# EAGLE design Plus (EAGLE 6.1)
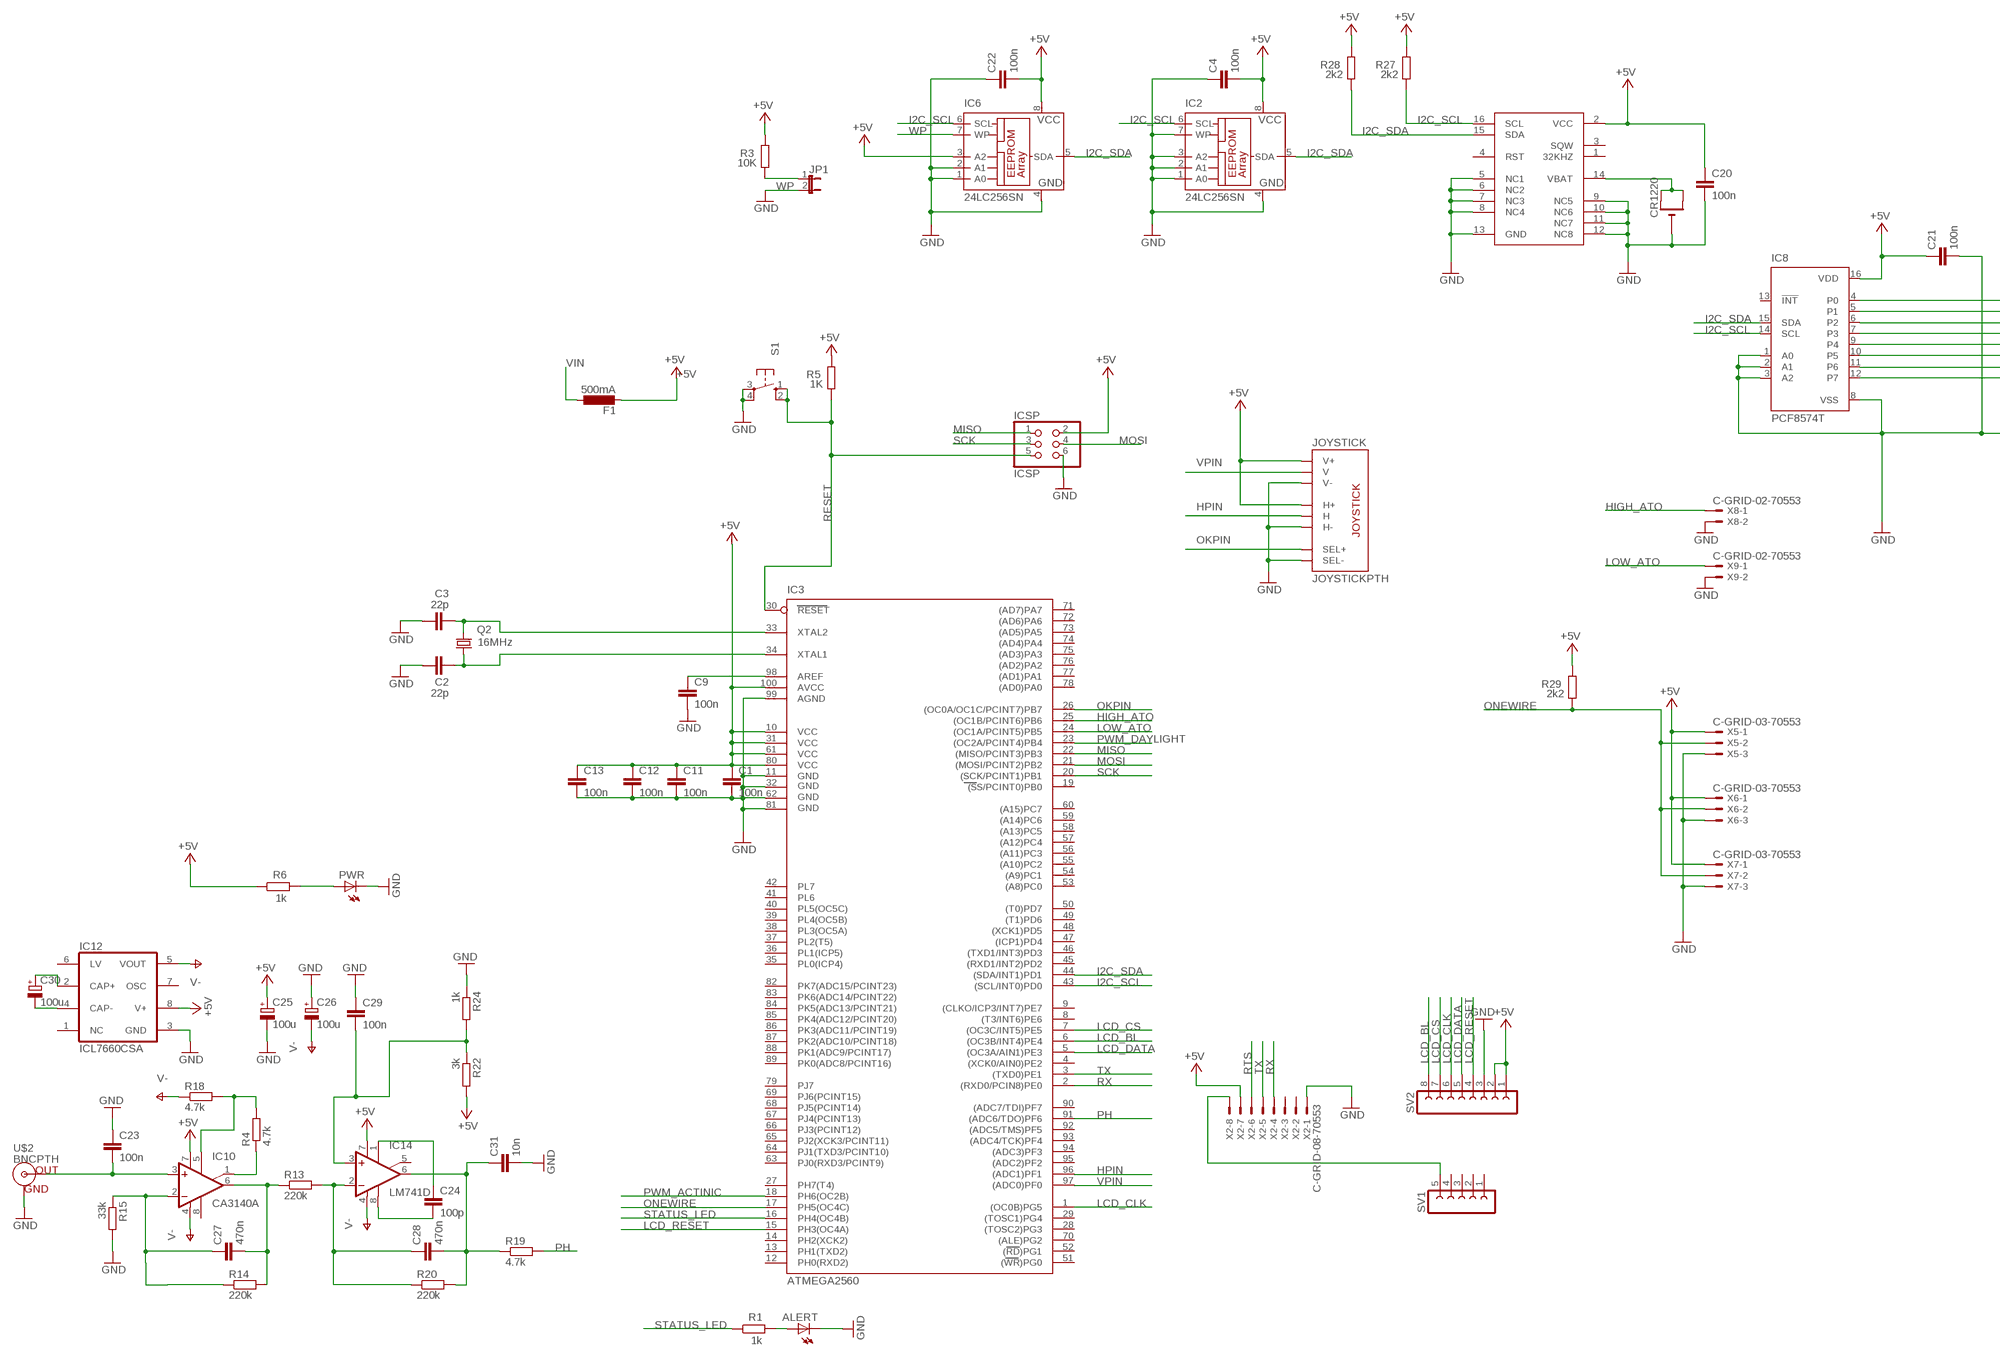
[diagram p0: schematic, sheet 1, part 1 of 2]
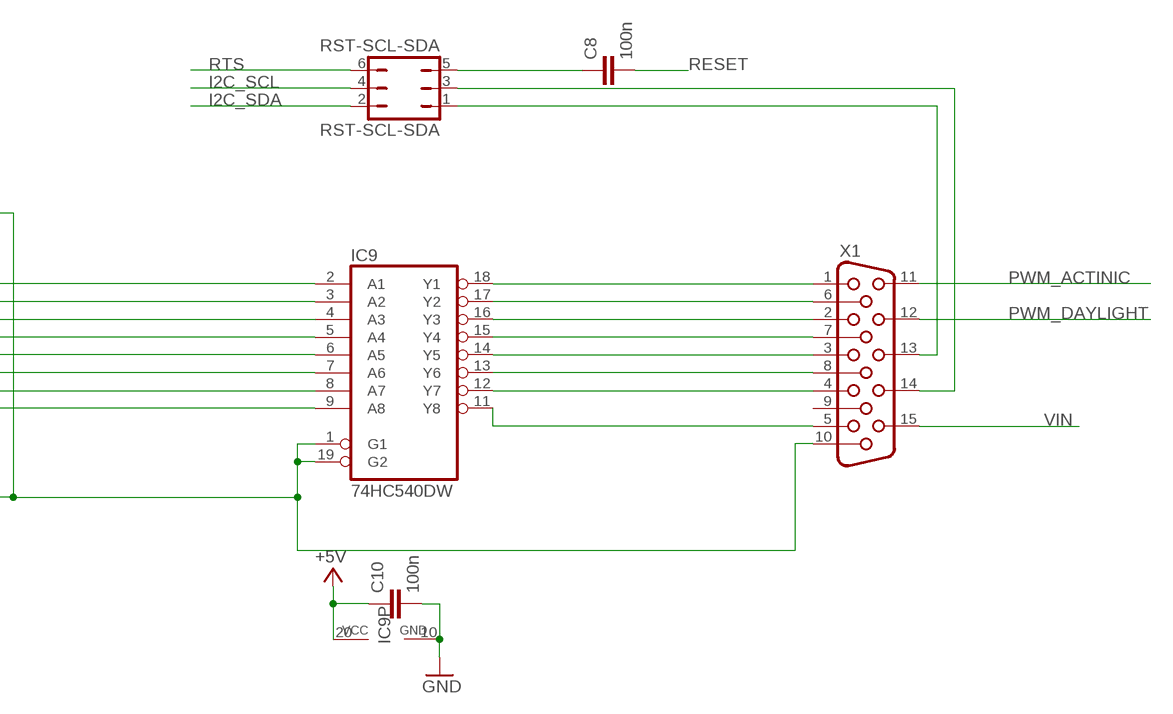
[diagram p1: schematic, sheet 1, part 2 of 2]

## Parts
ALERT  LED3MM  [LED3MM]
C1  100n  C-EUC0805  [C0805]
C2  22p  C-EUC0805  [C0805]
C3  22p  C-EUC0805  [C0805]
C4  100n  C-EUC0805  [C0805]
C8  100n  C-EUC0805  [C0805]
C9  100n  C-EUC0805  [C0805]
C10  100n  C-EUC0805  [C0805]
C11  100n  C-EUC0805  [C0805]
C12  100n  C-EUC0805  [C0805]
C13  100n  C-EUC0805  [C0805]
C20  100n  C-EUC0805  [C0805]
C21  100n  C-EUC0805  [C0805]
C22  100n  C-EUC0805  [C0805]
C23  100n  C-EUC0805  [C0805]
C24  100p  C-EUC0805  [C0805]
C25  100u  CPOL-EUD  [PANASONIC_D]
C26  100u  CPOL-EUD  [PANASONIC_D]
C27  470n  C-EUC0805  [C0805]
C28  470n  C-EUC0805  [C0805]
C29  100n  C-EUC0805  [C0805]
C30  100u  CPOL-EUD  [PANASONIC_D]
C31  10n  C-EUC0805  [C0805]
CR1220  CR1220SMT  [CR1220-SMD]
F1  500mA  L-EUL1812  [L1812]
IC2  24LC256SN  [SO-08]
IC3  ATMEGA2560  ATMEGA1280-16AU  [TQFP100]
IC6  24LC256SN  [SO-08]
IC7  DS3231W  [SO16W]
IC8  PCF8574T  [SO16W]
IC9  74HC540DW  [SO20W]
IC10  CA3140A  CA3140D  [SO08]
IC12  ICL7660CSA  [SO08]
IC14  LM741D  [SO08]
ICSP  ICSP  PINHD-2X3  [2X03]
JOYSTICK  JOYSTICKPTH  [JOYSTICK]
JP1  JP1E  [JP1]
PWR  LED3MM  [LED3MM]
Q2  16MHz  CRYTALHC49S  [HC49/S]
R1  1k  R-EU_R0805  [R0805]
R3  10K  R-EU_R0805  [R0805]
R4  4.7k  R-EU_R0805  [R0805]
R5  1K  R-EU_R0805  [R0805]
R6  1k  R-EU_R0805  [R0805]
R13  220k  R-EU_R0805  [R0805]
R14  220k  R-EU_R0805  [R0805]
R15  33k  R-EU_R0805  [R0805]
R18  4.7k  R-EU_R0805  [R0805]
R19  4.7k  R-EU_R0805  [R0805]
R20  220k  R-EU_R0805  [R0805]
R22  3k  R-EU_R0805  [R0805]
R24  1k  R-EU_R0805  [R0805]
R27  2k2  R-EU_R0805  [R0805]
R28  2k2  R-EU_R0805  [R0805]
R29  2k2  R-EU_R0805  [R0805]
RST-SCL-SDA  RST-SCL-SDA  JP3Q  [JP3Q]
S1  10-XX  [B3F-10XX]
SV1  FE05-1  [FE05-1]
SV2  FE08-1  [FE08]
U$2  BNCPTH  [BNC]
X1  HF15H  [HDF15H]
X2  C-GRID-08-70553  [70553-08]
X5  C-GRID-03-70553  [70553-03]
X6  C-GRID-03-70553  [70553-03]
X7  C-GRID-03-70553  [70553-03]
X8  C-GRID-02-70553  [70553-02]
X9  C-GRID-02-70553  [70553-02]

## Nets
+5V: C1.1 C4.2 C10.1 C11.1 C12.1 C13.1 C20.1 C21.1 C22.2 C25.+ F1.2 IC2.8(VCC) IC3.10(VCC) IC3.31(VCC1) IC3.61(VCC2) IC3.80(VCC3) IC3.100(AVCC) IC6.3(A2) IC6.8(VCC) IC7.2(VCC) IC8.16(VDD) IC9.20(VCC) IC10.7(V+) IC12.8(V+) IC14.7(V+) ICSP.2 JOYSTICK.H1(H+) JOYSTICK.V1(V+) R3.2 R5.2 R6.1 R22.2 R27.2 R28.2 R29.2 SV2.1 SV2.2 X2.7 X5.1 X6.1 X7.1
GND [gnd]: ALERT.K(C) C1.2 C2.1 C3.1 C4.1 C9.2 C10.2 C11.2 C12.2 C13.2 C20.2 C21.2 C22.1 C23.1 C25.- C26.+ C29.1 C31.2 CR1220.- IC2.1(A0) IC2.2(A1) IC2.3(A2) IC2.4(GND) IC2.7(WP) IC3.11(GND) IC3.32(GND1) IC3.62(GND2) IC3.81(GND3) IC3.99(AGND) IC6.1(A0) IC6.2(A1) IC6.4(GND) IC7.5(NC1) IC7.6(NC2) IC7.7(NC3) IC7.8(NC4) IC7.9(NC5) IC7.10(NC6) IC7.11(NC7) IC7.12(NC8) IC7.13(GND) IC8.1(A0) IC8.2(A1) IC8.3(A2) IC8.8(VSS) IC9.1(G1) IC9.10(GND) IC9.19(G2) IC12.3(GND) ICSP.6 JOYSTICK.B2A(SEL-) JOYSTICK.H3(H-) JOYSTICK.V3(V-) JP1.2 PWR.K(C) R15.2 R24.1 S1.3(P) S1.4(P1) SV2.3 U$2.GND X1.10 X2.1 X5.3 X6.3 X7.3 X8.2 X9.2
HIGH_ATO: IC3.25((OC1B/PCINT6)PB6) X8.1
HPIN: IC3.96((ADC1)PF1) JOYSTICK.H2(H)
I2C_SCL: IC2.6(SCL) IC3.43((SCL/INT0)PD0) IC6.6(SCL) IC7.16(SCL) IC8.14(SCL) R27.1 RST-SCL-SDA.4
I2C_SDA: IC2.5(SDA) IC3.44((SDA/INT1)PD1) IC6.5(SDA) IC7.15(SDA) IC8.15(SDA) R28.1 RST-SCL-SDA.2
LCD_BL: IC3.6((OC3B/INT4)PE4) SV2.8
LCD_CLK: IC3.1((OC0B)PG5) SV2.6
LCD_CS: IC3.7((OC3C/INT5)PE5) SV2.7
LCD_DATA: IC3.5((OC3A/AIN1)PE3) SV2.5
LCD_RESET: IC3.15(PH3(OC4A)) SV2.4
LOW_ATO: IC3.24((OC1A/PCINT5)PB5) X9.1
MISO: IC3.22((MISO/PCINT3)PB3) ICSP.1
MOSI: IC3.21((MOSI/PCINT2)PB2) ICSP.4
N$1: C9.1 IC3.98(AREF)
N$2: CR1220.+$1(+) CR1220.+$2(+1) IC7.14(VBAT)
N$3: PWR.A R6.2
N$6: C2.2 IC3.34(XTAL1) Q2.1
N$7: C3.2 IC3.33(XTAL2) Q2.2
N$8: IC9.18(Y1) X1.1
N$12: C24.1 IC14.1(ON1)
N$16: RST-SCL-SDA.1 X1.13
N$17: IC9.17(Y2) X1.6
N$20: RST-SCL-SDA.3 X1.14
N$21: IC9.16(Y3) X1.2
N$23: IC9.15(Y4) X1.7
N$25: IC9.14(Y5) X1.3
N$26: IC9.13(Y6) X1.8
N$27: IC9.12(Y7) X1.4
N$28: IC9.11(Y8) X1.5
N$29: IC8.4(P0) IC9.2(A1)
N$30: IC8.5(P1) IC9.3(A2)
N$32: IC8.6(P2) IC9.4(A3)
N$33: IC8.7(P3) IC9.5(A4)
N$34: IC8.9(P4) IC9.6(A5)
N$35: IC8.10(P5) IC9.7(A6)
N$36: IC8.11(P6) IC9.8(A7)
N$39: IC8.12(P7) IC9.9(A8)
N$41: C29.2 IC14.3(+IN) R22.1 R24.2
N$42: C30.- IC12.4(CAP-)
N$43: C30.+ IC12.2(CAP+)
N$44: C23.2 IC10.3(+IN) U$2.S(OUT)
N$45: C24.2 IC14.8(OPT)
N$47: C27.2 IC10.6(OUT) R13.1 R14.2
N$48: C27.1 IC10.2(-IN) R14.1 R15.1
N$49: C8.1 RST-SCL-SDA.5
N$50: IC10.5(ON) R4.2 R18.2
N$51: IC10.1(ON/CMP) R4.1
N$53: C28.1 IC14.2(-IN) R13.2 R20.1
N$55: C28.2 C31.1 IC14.6(OUT) R19.1 R20.2
N$63: ALERT.A R1.2
N$72: SV1.5 X2.8
OKPIN: IC3.26((OC0A/OC1C/PCINT7)PB7) JOYSTICK.B1A(SEL+)
ONEWIRE: IC3.17(PH5(OC4C)) R29.1 X5.2 X6.2 X7.2
PH: IC3.91((ADC6/TDO)PF6) R19.2
PWM_ACTINIC: IC3.18(PH6(OC2B)) X1.11
PWM_DAYLIGHT: IC3.23((OC2A/PCINT4)PB4) X1.12
RESET: C8.2 IC3.30(RESET) ICSP.5 R5.1 S1.1(S) S1.2(S1)
RTS: RST-SCL-SDA.6 X2.6
RX: IC3.2((RXD0/PCIN8)PE0) X2.4
SCK: IC3.20((SCK/PCINT1)PB1) ICSP.3
STATUS_LED: IC3.16(PH4(OC4B)) R1.1
TX: IC3.3((TXD0)PE1) X2.5
V-: C26.- IC10.4(V-) IC12.5(VOUT) IC14.4(V-) R18.1
VIN [power]: F1.1 X1.15
VPIN: IC3.97((ADC0)PF0) JOYSTICK.V2(V)
WP: IC6.7(WP) JP1.1 R3.1
Unconnected: IC3.4((XCK0/AIN0)PE2) IC3.8((T3/INT6)PE6) IC3.9((CLKO/ICP3/INT7)PE7) IC3.12(PH0(RXD2)) IC3.13(PH1(TXD2)) IC3.14(PH2(XCK2)) IC3.19((SS/PCINT0)PB0) IC3.27(PH7(T4)) IC3.28((TOSC2)PG3) IC3.29((TOSC1)PG4) IC3.35(PL0(ICP4)) IC3.36(PL1(ICP5)) IC3.37(PL2(T5)) IC3.38(PL3(OC5A)) IC3.39(PL4(OC5B)) IC3.40(PL5(OC5C)) IC3.41(PL6) IC3.42(PL7) IC3.45((RXD1/INT2)PD2) IC3.46((TXD1/INT3)PD3) IC3.47((ICP1)PD4) IC3.48((XCK1)PD5) IC3.49((T1)PD6) IC3.50((T0)PD7) IC3.51((WR)PG0) IC3.52((RD)PG1) IC3.53((A8)PC0) IC3.54((A9)PC1) IC3.55((A10)PC2) IC3.56((A11)PC3) IC3.57((A12)PC4) IC3.58((A13)PC5) IC3.59((A14)PC6) IC3.60((A15)PC7) IC3.63(PJ0(RXD3/PCINT9)) IC3.64(PJ1(TXD3/PCINT10)) IC3.65(PJ2(XCK3/PCINT11)) IC3.66(PJ3(PCINT12)) IC3.67(PJ4(PCINT13)) IC3.68(PJ5(PCINT14)) IC3.69(PJ6(PCINT15)) IC3.70((ALE)PG2) IC3.71((AD7)PA7) IC3.72((AD6)PA6) IC3.73((AD5)PA5) IC3.74((AD4)PA4) IC3.75((AD3)PA3) IC3.76((AD2)PA2) IC3.77((AD1)PA1) IC3.78((AD0)PA0) IC3.79(PJ7) IC3.82(PK7(ADC15/PCINT23)) IC3.83(PK6(ADC14/PCINT22)) IC3.84(PK5(ADC13/PCINT21)) IC3.85(PK4(ADC12/PCINT20)) IC3.86(PK3(ADC11/PCINT19)) IC3.87(PK2(ADC10/PCINT18)) IC3.88(PK1(ADC9/PCINT17)) IC3.89(PK0(ADC8/PCINT16)) IC3.90((ADC7/TDI)PF7) IC3.92((ADC5/TMS)PF5) IC3.93((ADC4/TCK)PF4) IC3.94((ADC3)PF3) IC3.95((ADC2)PF2) IC7.1(32KHZ) IC7.3(SQW) IC7.4(RST) IC8.13(!INT) IC10.8(CMP) IC12.1(NC) IC12.6(LV) IC12.7(OSC) IC14.5(ON2) SV1.1 SV1.2 SV1.3 SV1.4 X1.9 X2.2 X2.3

## Library data of the parts
ALERT PWR = led:LED: LED OSRAM: - CHIPLED LG R971, LG N971, LY N971, LG Q971, LY Q971, LO R971, LY R971 LH N974, LH R974 LS Q976, LO Q976, LY Q976 LO Q996 - Hyper CHIPLED LW Q18S LB Q993, LB Q99A, LB R99A - SideLED LS A670, LO A670, LY A670, LG A670, LP A670 LB A673, LV A673, LT A673, LW A673 LH A674 LY A675 LS A676, LA A676, LO A676, LY A676, LW A676 LS A679, LY A679, LG A679 - Hyper Micro SIDELED® LS Y876, LA Y876, LO Y876, LY Y876 LT Y87S - SmartLED LW L88C, LW L88S LB L89C, LB L89S, LG L890 LS L89K, LO L89K, LY L89K LS L896, LA L896, LO L896, LY L896 - TOPLED LS T670, LO T670, LY T670, LG T670, LP T670 LSG T670, LSP T670, LSY T670, LOP T670, LYG T670 LG T671, LOG T671, LSG T671 LB T673, LV T673, LT T673, LW T673 LH T674 LS T676, LA T676, LO T676, LY T676, LB T676, LH T676, LSB T676, LW T676 LB T67C, LV T67C, LT T67C, LS T67K, LO T67K, LY T67K, LW E67C LS E67B, LA E67B, LO E67B, LY E67B, LB E67C, LV E67C, LT E67C LW T67C LS T679, LY T679, LG T679 LS T770, LO T770, LY T770, LG T770, LP T770 LB T773, LV T773, LT T773, LW T773 LH T774 LS E675, LA E675, LY E675, LS T675 LS T776, LA T776, LO T776, LY T776, LB T776 LHGB T686 LT T68C, LB T68C - Hyper Mini TOPLED® LB M676 - Mini TOPLED Santana® LG M470 LS M47K, LO M47K, LY M47K Source: http://www.osram.convergy.de LUXEON: - LUMILED® LXK2-PW12-R00, LXK2-PW12-S00, LXK2-PW14-U00, LXK2-PW14-V00 LXK2-PM12-R00, LXK2-PM12-S00, LXK2-PM14-U00 LXK2-PE12-Q00, LXK2-PE12-R00, LXK2-PE12-S00, LXK2-PE14-T00, LXK2-PE14-U00 LXK2-PB12-K00, LXK2-PB12-L00, LXK2-PB12-M00, LXK2-PB14-N00, LXK2-PB14-P00, LXK2-PB14-Q00 LXK2-PR12-L00, LXK2-PR12-M00, LXK2-PR14-Q00, LXK2-PR14-R00 LXK2-PD12-Q00, LXK2-PD12-R00, LXK2-PD12-S00 LXK2-PH12-R00, LXK2-PH12-S00 LXK2-PL12-P00, LXK2-PL12-Q00, LXK2-PL12-R00 Source: www.luxeon.com KINGBRIGHT: KA-3528ASYC Source: www.kingbright.com
C1-C4 C8-C13 C20-C24 C27-C29 C31 = rcl:C-EU: CAPACITOR, European symbol
C25 C26 C30 = rcl:CPOL-EU: POLARIZED CAPACITOR, European symbol
CR1220 = adafruit:CR1220: CR1216/CR1220/CR1225 12mm 3V lithium coin cell Great for battery packup. Both SMT and THM holders. Note the THM package has the ground pads on both sides of the PCB so that the masks are the same - this reduces the cost
F1 = rcl:L-EU: INDUCTOR, European symbol
IC2 IC6 = microchip:24*: Serial EEPROM I2C
IC3 = atmel-2005:ATMEGA*: MICROCONTROLLER 64/128/256 Kbytes FLASH 4 Kbytes EEPROM 8 Kbytes SRAM 86 General Purpose I/O pins 12-channels16-bit PWM 4 x Serial USARTs 16-channels 10-bit A/D
IC7 = DS3231:DS3231
IC8 = micro-philips:PCF8574: I2C-Bus Remote 8-bit I/O expander http://www.semiconductors.philips.com/acrobat_download/datasheets/PCF8574_4.pdf
IC9 = 74xx-eu:74*540: Octal BUFFER and LINE DRIVER, 3-state
IC10 = linear:CA3140: OP AMP
IC12 = maxim:ICL7660CSA: VOLTAGE CONVERTER
IC14 = linear:*741: OP AMP
ICSP = pinhead:PINHD-2X3: PIN HEADER
JOYSTICK = SparkFun:JOYSTICK: Thumb Joystick Joystick commonly found in PS2 controllers. Two pots and a select switch. Footprint proven. Spark Fun Electronics SKU : COM-09032
JP1 = jumper:JP1E: JUMPER
Q2 = crystal:CRYTAL: CRYSTAL
R1 R3-R6 R13-R15 R18-R20 R22 R24 R27-R29 = rcl:R-EU_: RESISTOR, European symbol
RST-SCL-SDA = jumper:JP3Q: JUMPER
S1 = switch-omron:10-XX: OMRON SWITCH
SV1 = con-lsta:FE05-1: FEMALE HEADER
SV2 = con-lsta:FE08-1: FEMALE HEADER
U$2 = SparkFun:BNC: BNC Connector, Mouser Part# 5227161
X1 = con-subd:HF15: SUB-D
X2 = con-molex:C-GRID-08: CONNECTOR wire to board 2.54 mm (0.100") pitch header
X5-X7 = con-molex:C-GRID-03: CONNECTOR wire to board 2.54 mm (0.100") pitch header
X8 X9 = con-molex:C-GRID-02: CONNECTOR wire to board 2.54 mm (0.100") pitch header

## Net classes
0 default: width 0.254 mm, drill 0.254 mm, clearance 0.203 mm
1 power: width 0.61 mm, drill 0.508 mm, clearance 0.203 mm
2 gnd: width 0.254 mm, drill 0.508 mm, clearance 0.203 mm
3 usbvcc: width 0.508 mm, drill 0.508 mm, clearance 0.203 mm
4 aref: width 0.406 mm, clearance 0.203 mm

## Board
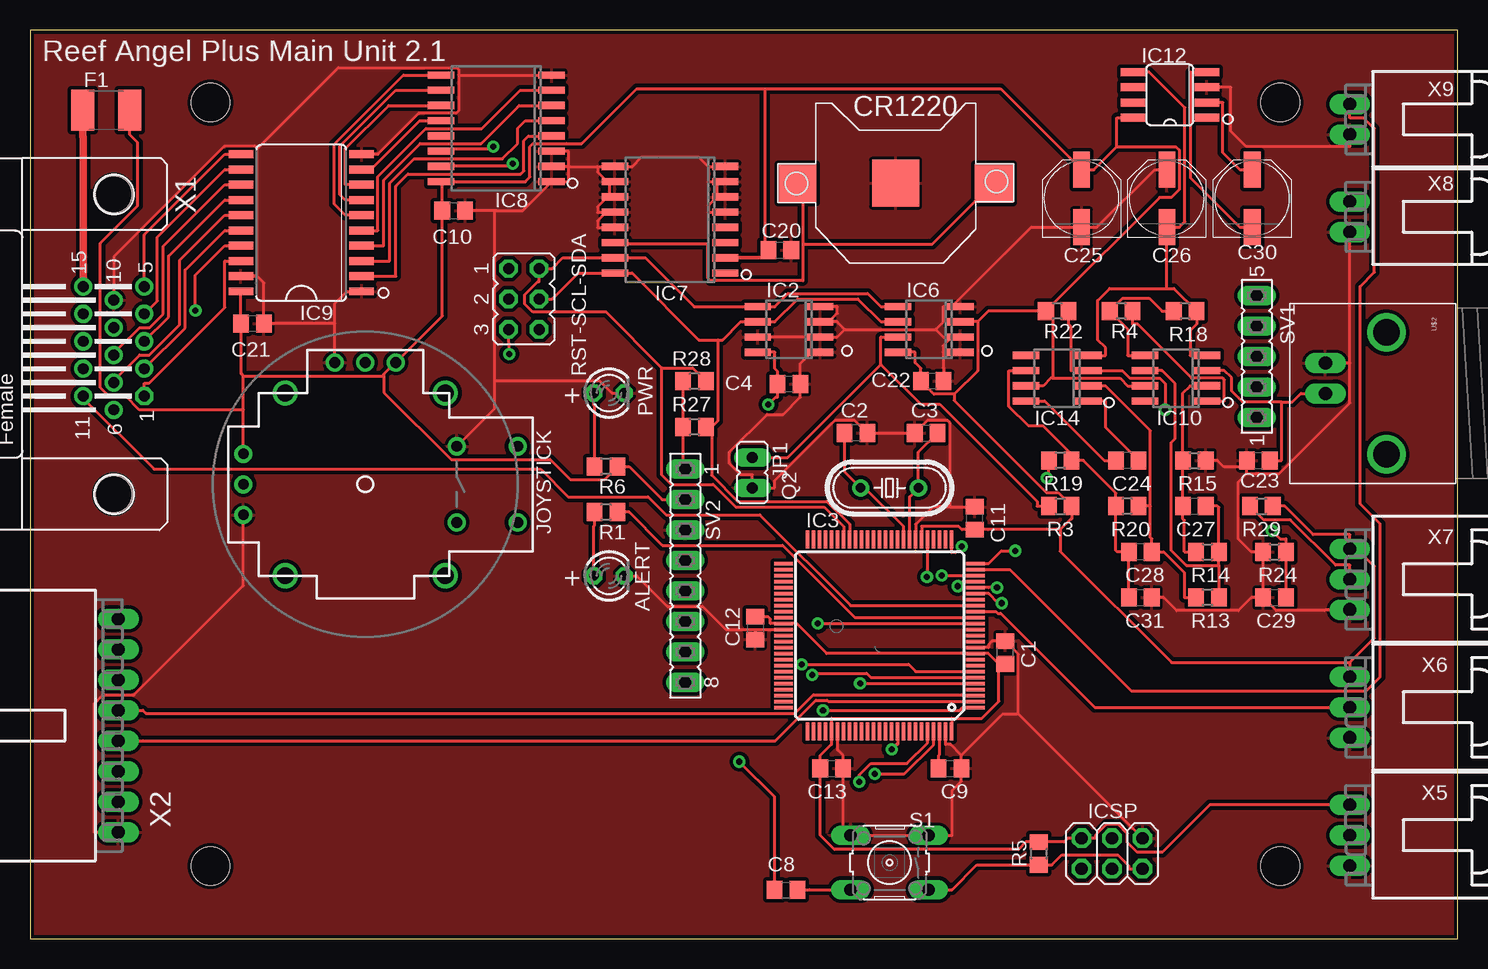
[diagram p2: board, top side]
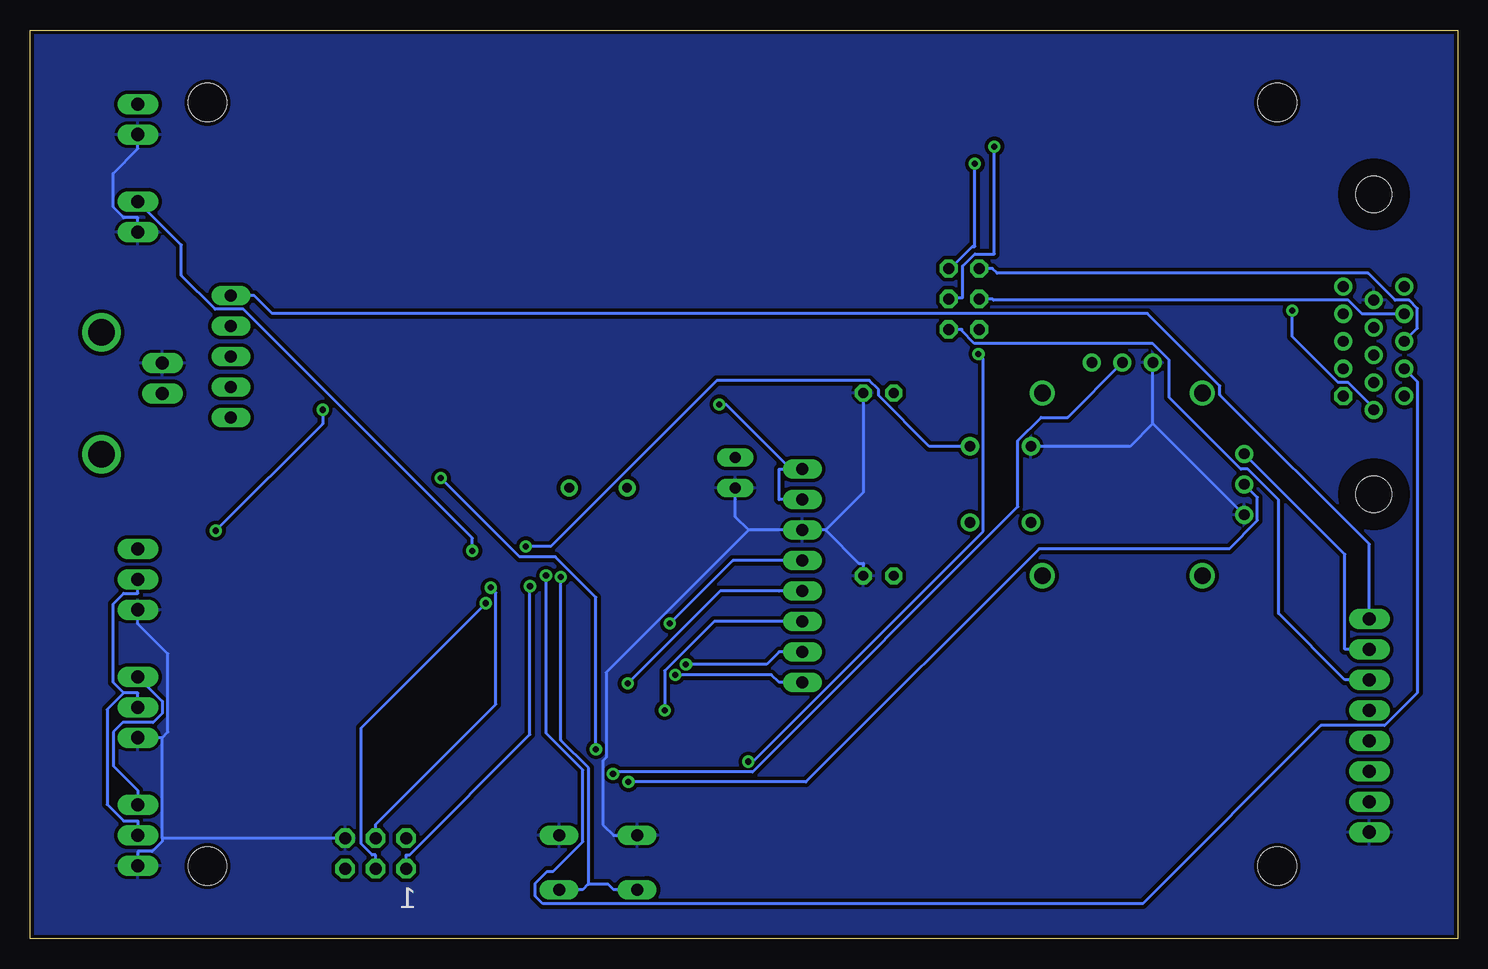
[diagram p3: board, bottom side, seen from below]

Size 118.97 x 75.77 mm. Coordinates in mm from the lower left corner, seen from the top.
Outline: 118.97,0 118.97,75.77 0,75.77 0,0 118.97,0
Copper layers (1*16): Top 0.035mm / dielectric 1.5mm / Bottom 0.035mm
Design rules: minimum track width 8mil, minimum drill 20mil, track to track 8mil, track to pad 8mil, pad to pad 8mil, via to via 8mil, smd to smd 8mil, copper to edge 10mil, drill to drill 8mil, minimum pad ring 12mil, minimum via ring 10mil, stop-mask expansion 4mil, vias tented up to drill 25mil, thermal gap 10mil
Holes 3.2 mm at 15.04,6.06 15.04,69.71 104.19,69.71 104.19,6.06
tKeepout: area 12.2,66.9 to 17.9,72.6; area 12.2,3.2 to 17.9,8.9; area 101.4,3.2 to 107,8.9; area 101.4,66.9 to 107,72.6; area 4.5,59.2 to 10.2,64.9; area 4.5,34.2 to 10.2,39.9
bKeepout: area 12.2,66.9 to 17.9,72.6; area 4.5,59.2 to 10.2,64.9; area 4.5,34.2 to 10.2,39.9; area 12.2,3.2 to 17.9,8.9; area 101.4,66.9 to 107,72.6; area 101.4,3.2 to 107,8.9

### Footprints (pad centres in the part's own frame; a part is rotated, then mirrored left to right if it is on the bottom)
LED3MM = drill 0.813 octagon: A -1.27,0; K 1.27,0
C0805 = smd 1.3 x 1.5: 1 -0.95,0; 2 0.95,0
PANASONIC_D = smd 3 x 1.4: + 2.4,0; - -2.4,0
CR1220-SMD = smd 3.2 x 3.2: +$1 -8.2,0; +$2 8.2,0 | smd 3.9 x 3.9: - 0,0
L1812 = smd 1.9 x 3.4: 1 -1.95,0; 2 1.95,0
SO-08 = smd 0.6 x 2.2: 1 -1.905,-2.6; 2 -0.635,-2.6; 3 0.635,-2.6; 4 1.905,-2.6; 5 1.905,2.6; 6 0.635,2.6; 7 -0.635,2.6; 8 -1.905,2.6
TQFP100 = smd 1.524 x 0.292: 1 -8,6; 2 -8,5.5; 3 -8,5; 4 -8,4.5; 5 -8,4; 6 -8,3.5; 7 -8,3; 8 -8,2.5; 9 -8,2; 10 -8,1.5; 11 -8,1; 12 -8,0.5; 13 -8,0; 14 -8,-0.5; 15 -8,-1; 16 -8,-1.5; 17 -8,-2; 18 -8,-2.5; 19 -8,-3; 20 -8,-3.5; 21 -8,-4; 22 -8,-4.5; 23 -8,-5; 24 -8,-5.5; 25 -8,-6; 51 8,-6; 52 8,-5.5; 53 8,-5; 54 8,-4.5; 55 8,-4; 56 8,-3.5; 57 8,-3; 58 8,-2.5; 59 8,-2; 60 8,-1.5; 61 8,-1; 62 8,-0.5; 63 8,0; 64 8,0.5; 65 8,1; 66 8,1.5; 67 8,2; 68 8,2.5; 69 8,3; 70 8,3.5; 71 8,4; 72 8,4.5; 73 8,5; 74 8,5.5; 75 8,6 | smd 0.292 x 1.524: 26 -6,-8; 27 -5.5,-8; 28 -5,-8; 29 -4.5,-8; 30 -4,-8; 31 -3.5,-8; 32 -3,-8; 33 -2.5,-8; 34 -2,-8; 35 -1.5,-8; 36 -1,-8; 37 -0.5,-8; 38 0,-8; 39 0.5,-8; 40 1,-8; 41 1.5,-8; 42 2,-8; 43 2.5,-8; 44 3,-8; 45 3.5,-8; 46 4,-8; 47 4.5,-8; 48 5,-8; 49 5.5,-8; 50 6,-8; 76 6,8; 77 5.5,8; 78 5,8; 79 4.5,8; 80 4,8; 81 3.5,8; 82 3,8; 83 2.5,8; 84 2,8; 85 1.5,8; 86 1,8; 87 0.5,8; 88 0,8; 89 -0.5,8; 90 -1,8; 91 -1.5,8; 92 -2,8; 93 -2.5,8; 94 -3,8; 95 -3.5,8; 96 -4,8; 97 -4.5,8; 98 -5,8; 99 -5.5,8; 100 -6,8
SO16W = smd 0.6 x 2.2: 1 -4.445,-4.6; 2 -3.175,-4.6; 3 -1.905,-4.6; 4 -0.635,-4.6; 5 0.635,-4.6; 6 1.905,-4.6; 7 3.175,-4.6; 8 4.445,-4.6; 9 4.445,4.6; 10 3.175,4.6; 11 1.905,4.6; 12 0.635,4.6; 13 -0.635,4.6; 14 -1.905,4.6; 15 -3.175,4.6; 16 -4.445,4.6
SO20W = smd 0.66 x 2.032: 1 -5.715,-5.029; 2 -4.445,-5.029; 3 -3.175,-5.029; 4 -1.905,-5.029; 5 -0.635,-5.029; 6 0.635,-5.029; 7 1.905,-5.029; 8 3.175,-5.029; 9 4.445,-5.029; 10 5.715,-5.029; 11 5.715,5.029; 12 4.445,5.029; 13 3.175,5.029; 14 1.905,5.029; 15 0.635,5.029; 16 -0.635,5.029; 17 -1.905,5.029; 18 -3.175,5.029; 19 -4.445,5.029; 20 -5.715,5.029
SO08 = smd 0.6 x 2.2: 1 -1.905,-2.6; 2 -0.635,-2.6; 3 0.635,-2.6; 4 1.905,-2.6; 5 1.905,2.6; 6 0.635,2.6; 7 -0.635,2.6; 8 -1.905,2.6
SO08' = smd 0.66 x 2.032: 1 -1.905,-3.073; 2 -0.635,-3.073; 3 0.635,-3.073; 4 1.905,-3.073; 5 1.905,3.073; 6 0.635,3.073; 7 -0.635,3.073; 8 -1.905,3.073
2X03 = drill 1.016 octagon: 1 -2.54,-1.27; 2 -2.54,1.27; 3 0,-1.27; 4 0,1.27; 5 2.54,-1.27; 6 2.54,1.27
JOYSTICK = drill 0.9: B1A -3.175,12.7; B1B 3.175,12.7; B2A -3.175,7.62; B2B 3.175,7.62 | drill 0.889: H1 -2.54,-10.16; H2 0,-10.16; H3 2.54,-10.16; V1 -10.16,2.54; V2 -10.16,0; V3 -10.16,-2.54 | drill 1.397: MOUNT1 -7.62,6.668; MOUNT2 -7.62,-6.668; MOUNT3 7.62,-6.668; MOUNT4 7.62,6.668
JP1 = drill 0.914 long: 1 0,-1.27; 2 0,1.27
HC49/S = drill 0.813: 1 -2.413,0; 2 2.413,0
R0805 = smd 1.3 x 1.5: 1 -0.95,0; 2 0.95,0
JP3Q = drill 0.914 octagon: 1 -2.54,-1.27; 2 -2.54,1.27; 3 0,-1.27; 4 0,1.27; 5 2.54,-1.27; 6 2.54,1.27
B3F-10XX = drill 1.016 long: 1 -3.251,2.261; 2 3.251,2.261; 3 -3.251,-2.261; 4 3.251,-2.261
FE05-1 = drill 1 long: 1 -5.08,0; 2 -2.54,0; 3 0,0; 4 2.54,0; 5 5.08,0
FE08 = drill 1 long: 1 -8.89,0; 2 -6.35,0; 3 -3.81,0; 4 -1.27,0; 5 1.27,0; 6 3.81,0; 7 6.35,0; 8 8.89,0
BNC = drill 2.2: 3 -5.08,5.08; 4 5.08,5.08 | drill 1.1 long: GND -2.54,0; S 0,0
HDF15H = drill 0.9 octagon: 1 4.329,2.54 | drill 0.9: 2 2.043,2.54; 3 -0.243,2.54; 4 -2.529,2.54; 5 -4.815,2.54; 6 5.472,0; 7 3.186,0; 8 0.9,0; 9 -1.386,0; 10 -3.672,0; 11 4.329,-2.54; 12 2.043,-2.54; 13 -0.243,-2.54; 14 -2.529,-2.54; 15 -4.815,-2.54 | hole 3: -12.5,0; 12.5,0
70553-08 = drill 1.092 long: 1 -8.89,-7.62; 2 -6.35,-7.62; 3 -3.81,-7.62; 4 -1.27,-7.62; 5 1.27,-7.62; 6 3.81,-7.62; 7 6.35,-7.62; 8 8.89,-7.62
70553-03 = drill 1.092 long: 1 -2.54,-7.62; 2 0,-7.62; 3 2.54,-7.62
70553-02 = drill 1.092 long: 1 -1.27,-7.62; 2 1.27,-7.62

### Placement (x,y rotation side)
ALERT  48.26,30.26 0 top
C1  81.28,23.86 90 top
C2  68.83,42.16 180 top
C3  74.68,42.16 0 top
C4  63.25,46.23 180 top
C8  62.99,4.06 0 top
C9  76.66,14.21 0 top
C10  35.31,60.71 0 top
C11  78.74,35.05 90 top
C12  60.44,25.89 270 top
C13  66.8,14.21 0 top
C20  62.48,57.4 0 top
C21  18.54,51.31 0 top
C22  75.18,46.48 180 top
C23  102.36,39.88 0 top
C24  91.44,39.88 180 top
C25  87.63,61.72 90 top
C26  94.74,61.72 90 top
C27  97.03,36.07 0 top
C28  92.53,32.26 180 top
C29  103.71,28.45 0 top
C30  101.85,61.72 90 top
C31  92.53,28.45 0 top
CR1220  72.14,62.99 0 top
F1  6.35,69.09 0 top
IC2  63.25,50.8 90 top
IC3  70.79,25.28 180 top
IC6  74.93,50.8 90 top
IC7  53.34,59.94 90 top
IC8  38.86,67.56 90 top
IC9  22.61,59.69 90 top
IC10  95.5,46.74 90 top
IC12  ICL7660CSA  [SO08']  95,70.36 90 top
IC14  85.6,46.74 90 top
ICSP  90.17,7.11 0 top
JOYSTICK  27.94,37.88 270 top
JP1  60.2,38.86 180 top
PWR  48.26,45.5 0 top
Q2  71.63,37.59 0 top
R1  48.01,35.56 180 top
R3  85.85,36.07 0 top
R4  90.93,52.32 180 top
R5  84.07,7.11 90 top
R6  48.01,39.37 180 top
R13  98.12,28.45 180 top
R14  98.12,32.26 0 top
R15  97.03,39.88 0 top
R18  96.27,52.32 180 top
R19  85.85,39.88 180 top
R20  91.44,36.07 180 top
R22  85.6,52.32 180 top
R24  103.71,32.26 0 top
R27  55.37,42.67 180 top
R28  55.37,46.48 180 top
R29  102.62,36.07 0 top
RST-SCL-SDA  41.15,53.34 270 top
S1  71.63,6.35 180 top
SV1  102.23,48.55 90 top
SV2  54.61,30.26 270 top
U$2  107.95,45.47 270 top
X1  6.99,49.57 270 top
X2  -0.25,17.78 90 top
X5  117.6,8.64 270 top
X6  117.6,19.3 270 top
X7  117.6,29.97 270 top
X8  117.6,60.2 270 top
X9  117.6,68.33 270 top

### Tracks (layer width: path | path; a pad name or v marks a point on that pad's centre or on a via)
+5V  (via drill 0.51 pad 1.02)
  Top 0.254: C12.1 61.52,26.84 61.7,26.66 61.7,26.28 IC3.61 63.34,26.28 63.89,26.28 66.39,23.78 IC3.10 79.89,23.78 79.89,23.76 80.74,22.91 | v61.53,44.55 62.13,45.15 62.3,45.15 C4.2 62.3,47.31 62.08,47.53 62.08,48.9 IC2.8 | R28.2 R27.2 54.42,41.71 54.42,39.66 53.91,39.15 SV2.1 | 85.85,34.1 86.73,34.99 86.8,34.99 R3.2 85.67,37.2 84.7,37.2 77.01,44.88 77.01,45.4 | 109.98,23.02 95.13,23.02 85.85,32.3 85.85,34.1 | 85.85,34.1 79.82,34.1 C11.1 77.66,34.1 77.39,34.37 74.29,34.37 IC3.31 | 77.01,45.4 75.31,45.4 C22.2 74.23,47.56 73.76,48.04 73.76,48.9 IC6.8 | 78.96,51.44 78.96,47.35 77.01,45.4 | 78.96,51.44 79.85,52.32 R22.2 85.22,52.32 | 17.78,46.93 29.5,46.93 | 29.5,46.93 29.5,47.06 JOYSTICK.V1 34.36,51.92 C10.1 34.36,63.12 IC8.16 41.27,63.12 41.66,63.5 41.66,66.04 41.91,66.3 42.03,66.3 44.72,66.3 45.98,66.3 50.55,70.87 54.1,70.87 61.21,70.87 | 29.5,46.93 29.5,45.55 35.09,39.96 43.35,39.96 45.02,38.29 47.88,38.29 R6.1 49.94,39.37 52.67,36.64 52.67,36.61 SV2.2 | JOYSTICK.H1 17.78,44.09 | 17.78,44.09 17.78,46.93 | 17.78,44.09 9.11,44.09 7.96,45.24 6.56,45.24 5.86,45.94 5.86,58 8.97,61.1 8.97,66.39 8.3,67.06 F1.2 | 17.78,46.93 17.59,47.12 17.59,50.23 C21.1 17.58,51.31 IC9.20 | X5.1 98.32,11.18 94.36,7.22 92.25,7.22 91.44,8.04 91.44,8.76 90.67,9.54 89.69,9.54 88.77,8.62 88.77,8.38 ICSP.2 86.49,8.38 86.17,8.06 R5.2 82.99,8.06 82.39,7.45 67.03,7.45 65.85,8.63 C13.1 65.85,15.29 66.75,16.19 66.79,16.19 IC3.80 66.79,18.37 76.79,18.37 | 85.22,52.32 85.22,46.73 | 90.58,66.04 95.49,66.04 95.77,65.76 95.77,62.47 95.11,61.81 94.13,61.81 85.22,52.9 85.22,52.32 | 78.96,51.44 IC6.3
  Top 0.254: 76.79,18.37 79.32,18.37 80.74,19.79 80.74,22.91 | 76.79,18.37 IC3.100 | 85.22,46.73 90.84,46.73 91.47,46.1 IC10.7 | 85.22,46.73 85.06,46.73 84.43,46.1 IC14.7 | 109.98,23.02 X6.1 | 80.74,22.91 C1.1 | 109.98,33.1 112.03,31.06 112.03,25.07 109.98,23.02 | 109.98,33.1 109.98,33.69 106.92,33.69 104.55,36.07 R29.2 | 109.98,33.1 X7.1 | 90.58,66.04 88.66,64.12 88.14,64.12 C25.+ 80.89,70.87 61.21,70.87 | 90.58,66.04 90.58,68.45 IC12.8 | C20.1 61.53,56.77 IC7.2 61.21,56.77 61.21,70.87
  Bottom 0.254: 55.58,39.15 60.97,44.55 v61.53,44.55 | 55.58,39.15 56.55,39.15 56.55,36.61 SV2.2 | 55.58,39.15 SV2.1 | JOYSTICK.H1 9.4,32.04 9.4,24.13 X2.7 | X5.1 109.98,12.36 112.03,14.41 112.03,17.25 111.25,18.03 108.72,18.03 107.94,18.81 107.94,19.81 X6.1
GND
  Top 0.254: 82.36,18.73 82.36,23.73 C1.2 81.13,24.81 80.2,24.81 79.89,24.5 79.89,24.28 IC3.11 | 82.36,18.73 ICSP.6 | 82.36,18.73 81.05,18.73 77.61,15.29 | 77.61,15.29 76.71,16.19 76.29,16.19 IC3.99 | 35.71,72.01 35.71,69.04 35.51,68.83 32.41,68.83 28.98,65.41 IC9.10 | 18.94,65.88 25.7,72.64 35.54,72.64 35.71,72.47 35.71,72.01 | 35.71,72.01 42.03,72.01 IC8.8 | 18.94,55.24 18.94,65.88 | X1.10 6.99,56.85 16.2,66.07 18.75,66.07 18.94,65.88 | 18.94,55.24 19.49,54.69 C21.2 20.47,51.31 25.4,51.31 | 18.94,55.24 18.45,55.24 IC9.19 | 44.89,64.39 44.89,65.66 IC8.3 | 38.72,46.56 38.72,59.34 38.72,60.71 38.86,60.71 | JOYSTICK.B2A 38.72,44.22 38.72,46.56 | 38.72,46.56 47.43,46.56 48.49,45.5 PWR.K | 56.51,64.39 55.73,65.17 52.39,65.17 50.95,65.17 50.17,64.39 IC7.9 47.31,64.39 | 77.61,15.29 C9.2 77.61,13.13 76.83,12.35 76.83,8.61 S1.3 S1.4 67.75,9.23 C13.2 67.75,15.29 67.29,15.75 IC3.81 | 65.13,48.9 64.2,47.96 C4.1 64.2,45.15 62.76,43.71 61.42,43.71 58.29,40.57 58.29,39.63 59.24,38.68 60.2,38.68 JP1.2 60.48,37.59 62.05,37.59 62.05,38.21 67.09,43.24 68.7,43.24 C2.1 72.75,42.16 C3.1 74.81,43.24 76.41,43.24 76.63,43.03 76.63,36 | 44.89,64.39 44.89,63.12 IC8.1 41.05,60.71 38.86,60.71 | 44.89,64.39 IC8.2 | 25.4,51.31 25.4,52.97 26.4,53.98 IC9.1 | JOYSTICK.V3 25.4,51.31 | X2.1 5.33,8.89 5.33,19.59 6.06,20.32 8.65,20.32 17.78,29.45 JOYSTICK.H3 | 101.41,38.8 100.69,38.07 100.69,33.35 101.78,32.26 R24.1 C29.1 | R15.2 98.96,39.88 99.5,39.34 101.41,39.34 | 101.41,38.8 101.41,39.34 | 101.41,39.34 C23.1 | 76.81,52.7 82.75,58.64 83.43,59.32 C25.- 88.91,59.32 93.71,64.12 C26.+ | 76.81,52.7 76.1,52.7 76.1,51.43 75.47,50.8
  Top 0.254: 76.81,52.7 IC6.4 | IC7.13 47.31,59.31 47.31,59.86 48.02,60.58 | 48.02,60.58 47.31,60.58 47.31,61.04 48.12,61.85 48.25,61.85 | 48.02,60.58 IC7.12 | 65.13,48.9 65.13,50.16 | 44.89,64.39 47.31,64.39 | 65.13,50.16 IC2.7 | 65.13,50.16 IC2.2 67.28,50.16 67.91,50.8 | 65.13,48.9 IC2.1 | 48.25,61.85 48.56,61.85 IC7.11 | 48.25,63.12 48.25,61.85 | 101.41,38.8 104.11,38.8 109.99,44.68 109.99,48.01 | 109.99,48.01 U$2.GND | X8.2 109.98,57.75 109.99,57.74 109.99,48.01 | C29.1 101.78,28.45 100.7,27.37 95.54,27.37 94.46,28.45 C31.2 | C29.1 103.84,27.37 107.89,27.37 107.95,27.43 X7.3 | 48.25,63.12 48.12,63.12 47.31,63.93 47.31,64.39 | 48.25,63.12 48.38,63.12 IC7.10 | IC2.4 67.28,52.7 67.28,52.15 66.56,51.44 | 66.56,51.44 67.28,51.44 67.28,51.43 67.91,50.8 | 66.56,51.44 IC2.3 | 57.23,63.12 56.51,63.12 56.51,64.39 | 57.23,63.12 IC7.7 | 56.51,64.39 IC7.8 | 76.63,36 75.24,36 73.79,34.56 IC3.32 | 76.63,36 C11.2 | 67.91,50.8 75.47,50.8 | 60.44,25.78 C12.2 | 60.44,25.78 57.99,25.78 56.05,27.72 53.11,27.72 50.57,30.26 ALERT.K | 60.44,25.78 61.7,25.78 62.25,25.78 IC3.62 | 57.23,63.12 57.23,61.85 | 75.47,50.8 76.1,50.16 76.81,50.16 | 76.1,48.9 IC6.1 | C22.1 76.13,47.56 76.1,47.6 76.1,48.9 | 76.81,50.16 76.1,49.45 76.1,48.9 | 76.81,50.16 IC6.2 | IC7.5 56.51,60.58 56.51,61.13 57.23,61.85 | 57.23,61.85 IC7.6 | IC12.3 100.08,70.99 100.08,67.31 101.35,66.04 107.7,66.04 109.98,66.04 X9.2 | 38.86,60.71 C10.2
  Bottom 0.254: 59.09,34.07 70.97,22.19 70.97,15.11 71.23,14.85 71.23,9.51 70.33,8.61 S1.4 | 107.95,8.38 107.95,8.13 108.8,7.28 109.98,7.28 X5.3 | 107.95,8.38 107.95,16.76 | 107.95,8.38 93.85,8.38 ICSP.6 | JOYSTICK.H3 25.4,42.96 | 25.4,42.96 JOYSTICK.V3 | JOYSTICK.B2A 27.3,41.06 25.4,42.96 | 107.95,16.76 107.48,17.23 107.48,23.75 109.98,26.25 X7.3 | 52.67,34.07 49.53,37.21 49.53,44.46 PWR.K | X8.2 109.98,60.11 111.16,60.11 112.06,61 112.06,63.8 109.98,65.88 X9.2 | 107.95,16.76 X6.3 | 59.09,34.07 SV2.3 52.67,34.07 | 59.09,34.07 60.2,35.19 60.2,36.64 JP1.2 | ALERT.K 49.53,31.31 49.9,31.31 52.67,34.07
  pour Bottom (isolate 0.305): 0,75.77 118.97,75.77 118.97,0 0,0
  pour Top (isolate 0.305): 0,75.77 118.97,75.77 118.97,0 0,0
HIGH_ATO  (via drill 0.51 pad 1.02)
  Top 0.254: IC3.25 79.89,31.28 80.95,32.35 v82.11,32.35
  Bottom 0.254: X8.1 106.35,57.84 106.35,55.29 103.56,52.5 101.2,52.5 82.11,33.41 v82.11,32.35
HPIN  (via drill 0.51 pad 1.02)
  Top 0.254: v69.11,13.07 69.11,13.66 70.07,14.62 73.08,14.62 74.79,16.34 IC3.96
  Bottom 0.254: JOYSTICK.H2 16.69,36.79 16.69,34.88 19.05,32.52 34.88,32.52 54.32,13.07 v69.11,13.07
I2C_SCL  (via drill 0.51)
  Top 0.254: 57.32,49.93 57.71,49.93 59.22,51.44 IC2.6 62.08,51.44 63.98,53.34 69,53.34 70.9,51.44 IC6.6 | 57.32,49.93 55.74,49.93 50.17,55.5 IC7.16 45.67,55.5 43.51,53.34 RST-SCL-SDA.4 | 56.81,42.67 57.32,43.18 57.32,49.93 | IC3.43 68.29,34.57 66.4,36.47 58.99,36.47 56.81,38.65 56.81,42.67 | 56.81,42.67 R27.1 | v38.61,66.04 38.61,65.84 34.34,65.84 IC8.14
  Bottom 0.254: v38.61,66.04 38.61,57.1 40.23,57.1 41.25,56.08 41.25,53.44 42.27,53.44 RST-SCL-SDA.4
I2C_SDA  (via drill 0.51)
  Top 0.254: 52.66,47.59 52.66,38.64 53.42,37.88 56.93,37.88 58.83,35.99 66.18,35.99 67.79,34.37 IC3.44 | 52.66,47.59 48.01,52.25 41.91,52.25 41.24,52.91 41.24,53.73 42.3,54.79 42.42,54.79 RST-SCL-SDA.2 43.51,55.88 44.4,56.77 IC7.15 51.29,56.77 55.35,52.7 IC2.5 62.08,52.7 63.16,53.79 69.81,53.79 70.9,52.7 IC6.5 | R28.1 55.22,47.59 52.66,47.59 | v40.23,64.62 40.23,64.41 34.34,64.41 IC8.15
  Bottom 0.254: v40.23,64.62 40.23,57.71 40.44,57.71 42.27,55.88 RST-SCL-SDA.2
LCD_BL  (via drill 0.51 pad 1.02)
  Top 0.254: IC3.6 70.07,21.78 69.72,22.14 65.32,22.14 v65.19,22.01
  Bottom 0.254: v65.19,22.01 57.18,22.01 56.55,21.37 SV2.8
LCD_CLK  (via drill 0.51 pad 1.02)
  Top 0.254: IC3.1 77.7,19.28 77.47,19.05 v66.08,19.05
  Bottom 0.254: SV2.6 61.96,26.45 66.08,22.33 v66.08,19.05
LCD_CS  (via drill 0.51 pad 1.02)
  Top 0.254: IC3.7 73.81,22.28 73.21,22.88 v64.31,22.88
  Bottom 0.254: v64.31,22.88 57.59,22.88 56.55,23.91 SV2.7
LCD_DATA  (via drill 0.51 pad 1.02)
  Top 0.254: v69.17,21.28 IC3.5
  Bottom 0.254: v69.17,21.28 61.46,28.99 56.55,28.99 SV2.5
LCD_RESET  (via drill 0.51 pad 1.02)
  Top 0.254: v65.65,26.28 IC3.15
  Bottom 0.254: SV2.4 60.4,31.53 v65.65,26.28
LOW_ATO
  Top 0.254: X9.1 109.98,68.42 111.16,68.42 112.03,67.55 112.03,55.57 110.84,54.37 110.84,36.26 112.51,34.59 112.51,21.82 111.34,20.65 91.79,20.65 81.66,30.78 IC3.24
MISO  (via drill 0.51 pad 1.02)
  Top 0.254: v77.31,29.39 77.7,29.78 IC3.22
  Bottom 0.254: v77.31,29.39 77.31,17.02 87.34,6.99 87.63,6.99 ICSP.1
MOSI  (via drill 0.51 pad 1.02)
  Top 0.254: v80.59,29.27 79.89,29.27 79.89,29.28 IC3.21
  Bottom 0.254: v80.59,29.27 80.15,28.84 80.15,19.55 90.17,9.53 ICSP.4
N$1
  Top 0.254: C9.1 75.71,15.29 75.79,15.37 IC3.98
N$2
  Top 0.254: 64.41,57.91 64.41,62.59 64.01,62.99 CR1220.+$1 | 64.41,57.91 64.41,54.86 56.69,54.86 56.49,55.07 56.49,57.91 48.77,57.91 IC7.14 | 64.41,57.91 75.18,57.91 80.26,62.99 CR1220.+$2
N$3
  Top 0.254: PWR.A 46.99,44.46 47.06,44.4 R6.2
N$6
  Top 0.254: C2.2 67.88,38.92 Q2.1 69.58,37.59 72.79,34.37 IC3.34
N$7
  Top 0.254: IC3.33 73.29,36.84 Q2.2 74.04,40.58 C3.2
N$8
  Top 0.254: IC9.18 16.23,56.52 16.23,52.62 9.93,46.32 9.53,46.32 X1.1
N$12
  Top 0.254: IC14.1 89.63,44.83 89.63,42.64 C24.1
N$16
  Bottom 0.254: RST-SCL-SDA.1 38.79,55.88 38.38,55.48 7.46,55.48 5.22,53.24 4.04,53.24 3.35,52.55 3.35,50.9 X1.13
N$17  (via drill 0.51 pad 1.02)
  Top 0.254: v13.79,52.38 13.79,55.34 16.23,57.78 IC9.17
  Bottom 0.254: X1.6 6.99,44.24 9.13,46.38 9.96,46.38 13.79,50.21 v13.79,52.38
N$20
  Bottom 0.254: X1.14 7.96,52.1 9.1,53.24 38.69,53.24 38.79,53.34 RST-SCL-SDA.3
N$21
  Top 0.254: IC9.16 16.23,59.05 12.93,55.75 12.93,50.93 X1.2
N$23
  Top 0.254: X1.7 6.99,46.52 9.13,48.67 9.95,48.67 12.47,51.2 12.47,56.57 16.23,60.33 IC9.15
N$25
  Top 0.254: X1.3 11.56,51.84 11.56,56.92 16.23,61.59 IC9.14
N$26
  Top 0.254: X1.8 6.99,48.81 9.13,50.95 9.97,50.95 11.1,52.09 11.1,57.73 16.23,62.87 IC9.13
N$27
  Top 0.254: IC9.12 16.23,64.14 10.61,58.52 10.61,53.18 X1.4
N$28
  Top 0.254: IC9.11 16.23,65.41 9.53,58.7 X1.5
N$29
  Top 0.254: IC9.2 30.48,55.24 30.48,62.74 31.5,63.75 40.89,63.75 41.15,64.01 41.15,66.55 41.53,66.93 IC8.4
N$30
  Top 0.254: IC9.3 29.97,56.52 29.97,62.99 32,65.02 39.37,65.02 40.64,66.29 40.64,67.56 40.89,67.82 41.27,68.2 IC8.5
N$32
  Top 0.254: IC9.4 29.46,57.78 29.46,63.25 32.51,66.29 37.59,66.29 40.64,69.34 40.77,69.47 IC8.6
N$33
  Top 0.254: IC9.5 28.98,59.05 28.98,63.56 32.98,67.56 37.66,67.56 40.84,70.74 IC8.7
N$34
  Top 0.254: IC8.9 31.12,72.01 25.37,66.26 25.37,61.24 26.29,60.33 IC9.6
N$35
  Top 0.254: IC8.10 32.83,70.74 30.5,70.74 25.83,66.07 25.83,62.06 26.29,61.59 IC9.7
N$36
  Top 0.254: IC8.11 29.89,69.47 26.29,65.87 26.29,62.87 IC9.8
N$39
  Top 0.254: IC9.9 28.41,64.14 32.47,68.2 IC8.12
N$41  (via drill 0.51 pad 1.02)
  Top 0.254: v94.59,44.1 94.59,46.3 94.15,46.73 91.67,46.73 91.03,47.37 IC14.3 86.77,47.37 86.77,51.02 86.55,51.24 R22.1 | v103.49,34.02 104.18,33.34 104.66,33.34 R24.2 C29.2
  Bottom 0.254: v103.49,34.02 94.59,42.93 v94.59,44.1
N$42
  Top 0.254: C30.- 100.82,59.32 96.72,63.42 96.72,72.26 IC12.4
N$43
  Top 0.254: C30.+ 100.82,64.12 99.42,65.53 99.42,69.72 IC12.2
N$44
  Top 0.254: IC10.3 99.53,47.37 100.13,46.78 100.13,45.68 101.06,44.74 104.29,44.74 | 104.29,44.74 105.19,44.74 105.91,45.47 U$2.S | 104.29,44.74 104.29,39.88 C23.2
N$45
  Top 0.254: C24.2 89.51,39.88 84.56,44.83 IC14.8
N$47
  Top 0.254: 99.07,31.13 R13.1 | 99.07,31.13 R14.2 99.07,35.96 98.96,36.07 C27.2 | 99.07,31.13 96.36,31.13 95.1,32.39 95.1,41.37 95.43,41.71 95.43,46.27 94.33,47.37 IC10.6
N$48
  Top 0.254: IC10.2 96.67,46.1 96.08,45.51 R15.1 C27.1 96.08,35.53 96.08,34.99 96.19,34.88 96.19,32.26 R14.1
N$49  (via drill 0.51 pad 1.02)
  Top 0.254: C8.1 62.04,11.84 v59.11,14.77 | v39.94,48.75 39.94,49.65 39.88,49.71 RST-SCL-SDA.5
  Bottom 0.254: v59.11,14.77 58.76,14.77 39.55,33.98 39.55,48.37 v39.94,48.75
N$50
  Top 0.254: R18.2 94.34,52.32 93.25,53.4 91.06,53.4 R4.2 91.47,50.83 91.47,48.64 IC10.5
N$51
  Top 0.254: IC10.1 99.53,44.83 99.53,46.6 99.39,46.74 96.81,46.74 92.31,51.24 91.88,51.24 R4.1
N$53
  Top 0.254: IC14.2 89.63,46.1 93.37,42.36 93.37,36.07 | 93.37,36.07 93.26,36.07 R20.1 | 93.37,36.07 93.37,33.45 93.48,33.34 C28.1 94.46,32.26 96.19,30.53 96.19,28.45 R13.2
N$55
  Top 0.254: IC14.6 81.57,47.37 81.57,44.39 83.21,42.75 84.42,42.75 87.29,39.88 | 87.29,39.88 87.78,39.88 87.78,39.86 90.49,37.15 R20.2 90.49,32.37 90.6,32.26 C28.2 C31.1 | 87.29,39.88 R19.1
N$63
  Top 0.254: R1.2 47.06,34.48 46.99,34.41 ALERT.A
N$72
  Bottom 0.254: SV1.5 100.3,53.63 98.8,52.13 25.86,52.13 19.82,46.08 19.82,45.35 7.37,32.9 X2.8
OKPIN  (via drill 0.51 pad 1.02)
  Top 0.254: v77.65,32.72 77.13,32.19 76.79,32.19 IC3.26
  Bottom 0.254: v77.65,32.72 75.58,32.72 61.74,46.55 49.03,46.55 48.26,45.78 48.26,45.29 44.03,41.06 JOYSTICK.B1A
ONEWIRE
  Top 0.254: IC3.17 80.5,27.28 80.64,27.14 80.89,27.14 88.72,19.3 X6.2 | X7.2 109.98,31.15 108.8,31.15 105.03,34.93 102.81,34.93 R29.1
  Bottom 0.254: 111.16,20.48 109.98,20.48 X6.2 | 111.16,20.48 112.06,21.38 112.06,27.9 111.16,28.79 109.98,28.79 X7.2 | 111.16,20.48 112.55,19.1 112.55,11.2 111.16,9.82 109.98,9.82 X5.2
PH  (via drill 0.51 pad 1.02)
  Top 0.254: IC3.91 72.29,16.19 72.2,16.19 v71.81,15.8 | R19.2 84.9,38.57 v84.74,38.41
  Bottom 0.254: v84.74,38.41 78.18,31.84 75.19,31.84 71.81,28.46 v71.81,15.8
PWM_ACTINIC
  Top 0.254: X1.11 4.45,45.06 10.35,39.15 42.55,39.15 44.85,36.85 51.52,36.85 53.02,35.34 60.82,35.34 68.38,27.78 IC3.18
PWM_DAYLIGHT  (via drill 0.51 pad 1.02)
  Top 0.254: v75.97,30.28 IC3.23
  Bottom 0.254: X1.12 3.34,46.42 3.34,20.52 6.08,17.78 11.39,17.78 26.24,2.93 76.23,2.93 76.86,3.56 76.86,4.63 75.88,5.61 75.38,5.61 72.9,8.1 72.9,14.06 75.97,17.14 v75.97,30.28
RESET  (via drill 0.51 pad 1.02)
  Top 0.254: IC3.30 74.79,30.22 v74.74,30.17 | S1.1 76.83,4.09 78.91,6.16 R5.1 85.15,6.16 85.99,6.99 90.65,6.99 91.57,6.08 91.57,5.84 ICSP.5 | C8.2 64.92,4.06 64.95,4.09 S1.2
  Bottom 0.254: 72.42,4.52 72.42,14.24 74.74,16.56 v74.74,30.17 | 72.42,4.52 72.49,4.52 72.92,4.09 S1.1 | 72.42,4.52 70.77,4.52 70.33,4.09 S1.2
RTS
  Bottom 0.254: RST-SCL-SDA.6 41.33,50.8 41.33,50.69 40.27,49.63 25.42,49.63 24.04,48.25 24.04,45.12 18.07,39.15 17.48,39.15 14.93,36.6 14.93,27.12 9.4,21.59 X2.6
RX
  Top 0.254: IC3.2 66.54,19.78 66.43,19.89 65.5,19.89 62.12,16.51 9.4,16.51 X2.4
SCK  (via drill 0.51 pad 1.02)
  Top 0.254: IC3.20 79.89,28.78 80.69,27.98 v80.99,27.98
  Bottom 0.254: ICSP.3 90.17,6.99 90.46,6.99 91.36,7.89 91.36,17.6 v80.99,27.98
STATUS_LED
  Top 0.254: R1.1 49.94,35.56 52.69,32.8 62.71,32.8 68.73,26.78 IC3.16
TX
  Top 0.254: IC3.3 77.7,20.28 77.64,20.35 65.28,20.35 63.73,18.79 9.65,18.79 9.4,19.05 X2.5
V-
  Top 0.254: 94.74,54.22 89.97,54.22 88.97,53.22 88.97,49.93 89.63,49.27 89.63,48.64 IC14.4 | 94.74,54.22 95.32,54.22 R18.1 97.22,51.24 96.67,50.7 96.67,48.64 IC10.4 | 94.74,54.22 C26.- 95.77,59.32 96.23,59.78 96.23,69.3 93.27,72.26 IC12.5
VIN
  Top 0.61: F1.1 4.4,66.88 4.45,66.83 X1.15
VPIN  (via drill 0.51 pad 1.02)
  Top 0.254: v70.39,13.75 72.87,13.75 75.29,16.18 IC3.97
  Bottom 0.254: JOYSTICK.V2 32.51,43.47 34.71,43.47 36.65,41.53 36.65,36.02 58.75,13.91 70.24,13.91 v70.39,13.75
WP
  Top 0.254: 70.9,47.89 74.21,44.58 75.81,44.58 83.92,36.46 83.92,36.07 R3.1 | 70.9,47.89 70.9,50.16 IC6.7 | JP1.1 63.14,40.13 70.9,47.89

### Text on the board
tNames: Reef Angel Plus Main Unit 2.1 | + | +
bNames: 1